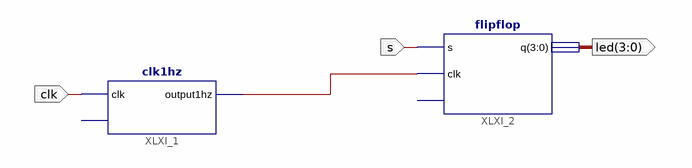
[diagram p0: schematic sheet 1]
// Xilinx ISE schematic top.sch (spartan3e) as structural Verilog: 2 symbols, 3 ports
module top (
  input  s,
  input  clk,
  output [3:0] led
);

  wire XLXN_1;

  flipflop XLXI_2 (.s(s), .clk(XLXN_1), .q(led));  // open: r
  clk1hz XLXI_1 (.clk(clk), .output1hz(XLXN_1));  // open: reset
endmodule
